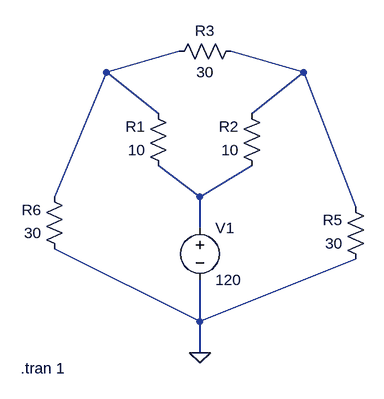
[diagram p0: schematic 3.58.asc]
3.58.asc, the LTspice schematic file:
Version 4
SHEET 1 880 680
WIRE 64 32 176 0
WIRE 368 32 256 0
WIRE 144 96 64 32
WIRE 288 96 368 32
WIRE -16 224 64 32
WIRE 208 224 144 176
WIRE 208 224 288 176
WIRE 448 240 368 32
WIRE 208 272 208 224
WIRE 208 416 -16 304
WIRE 208 416 448 320
WIRE 208 416 208 352
WIRE 208 464 208 416
FLAG 208 464 0
SYMBOL voltage 208 256 R0
WINDOW 123 0 0 Left 0
WINDOW 39 0 0 Left 0
SYMATTR InstName V1
SYMATTR Value 120
SYMBOL res 160 192 R180
WINDOW 0 36 76 Left 2
WINDOW 3 36 40 Left 2
SYMATTR InstName R1
SYMATTR Value 10
SYMBOL res 304 192 R180
WINDOW 0 36 76 Left 2
WINDOW 3 36 40 Left 2
SYMATTR InstName R2
SYMATTR Value 10
SYMBOL res 160 16 R270
WINDOW 0 32 56 VTop 2
WINDOW 3 0 56 VBottom 2
SYMATTR InstName R3
SYMATTR Value 30
SYMBOL res 0 320 R180
WINDOW 0 36 76 Left 2
WINDOW 3 36 40 Left 2
SYMATTR InstName R6
SYMATTR Value 30
SYMBOL res 464 336 R180
WINDOW 0 36 76 Left 2
WINDOW 3 36 40 Left 2
SYMATTR InstName R5
SYMATTR Value 30
TEXT -68 488 Left 2 !.tran 1

The netlist it stands for:
* 3.58.asc
V1 N003 0 120
R1 N003 N001 10
R2 N003 N002 10
R3 N001 N002 30
R6 0 N001 30
R5 0 N002 30
.tran 1
.backanno
.end